# Altium project PCB_Project.PrjPcb
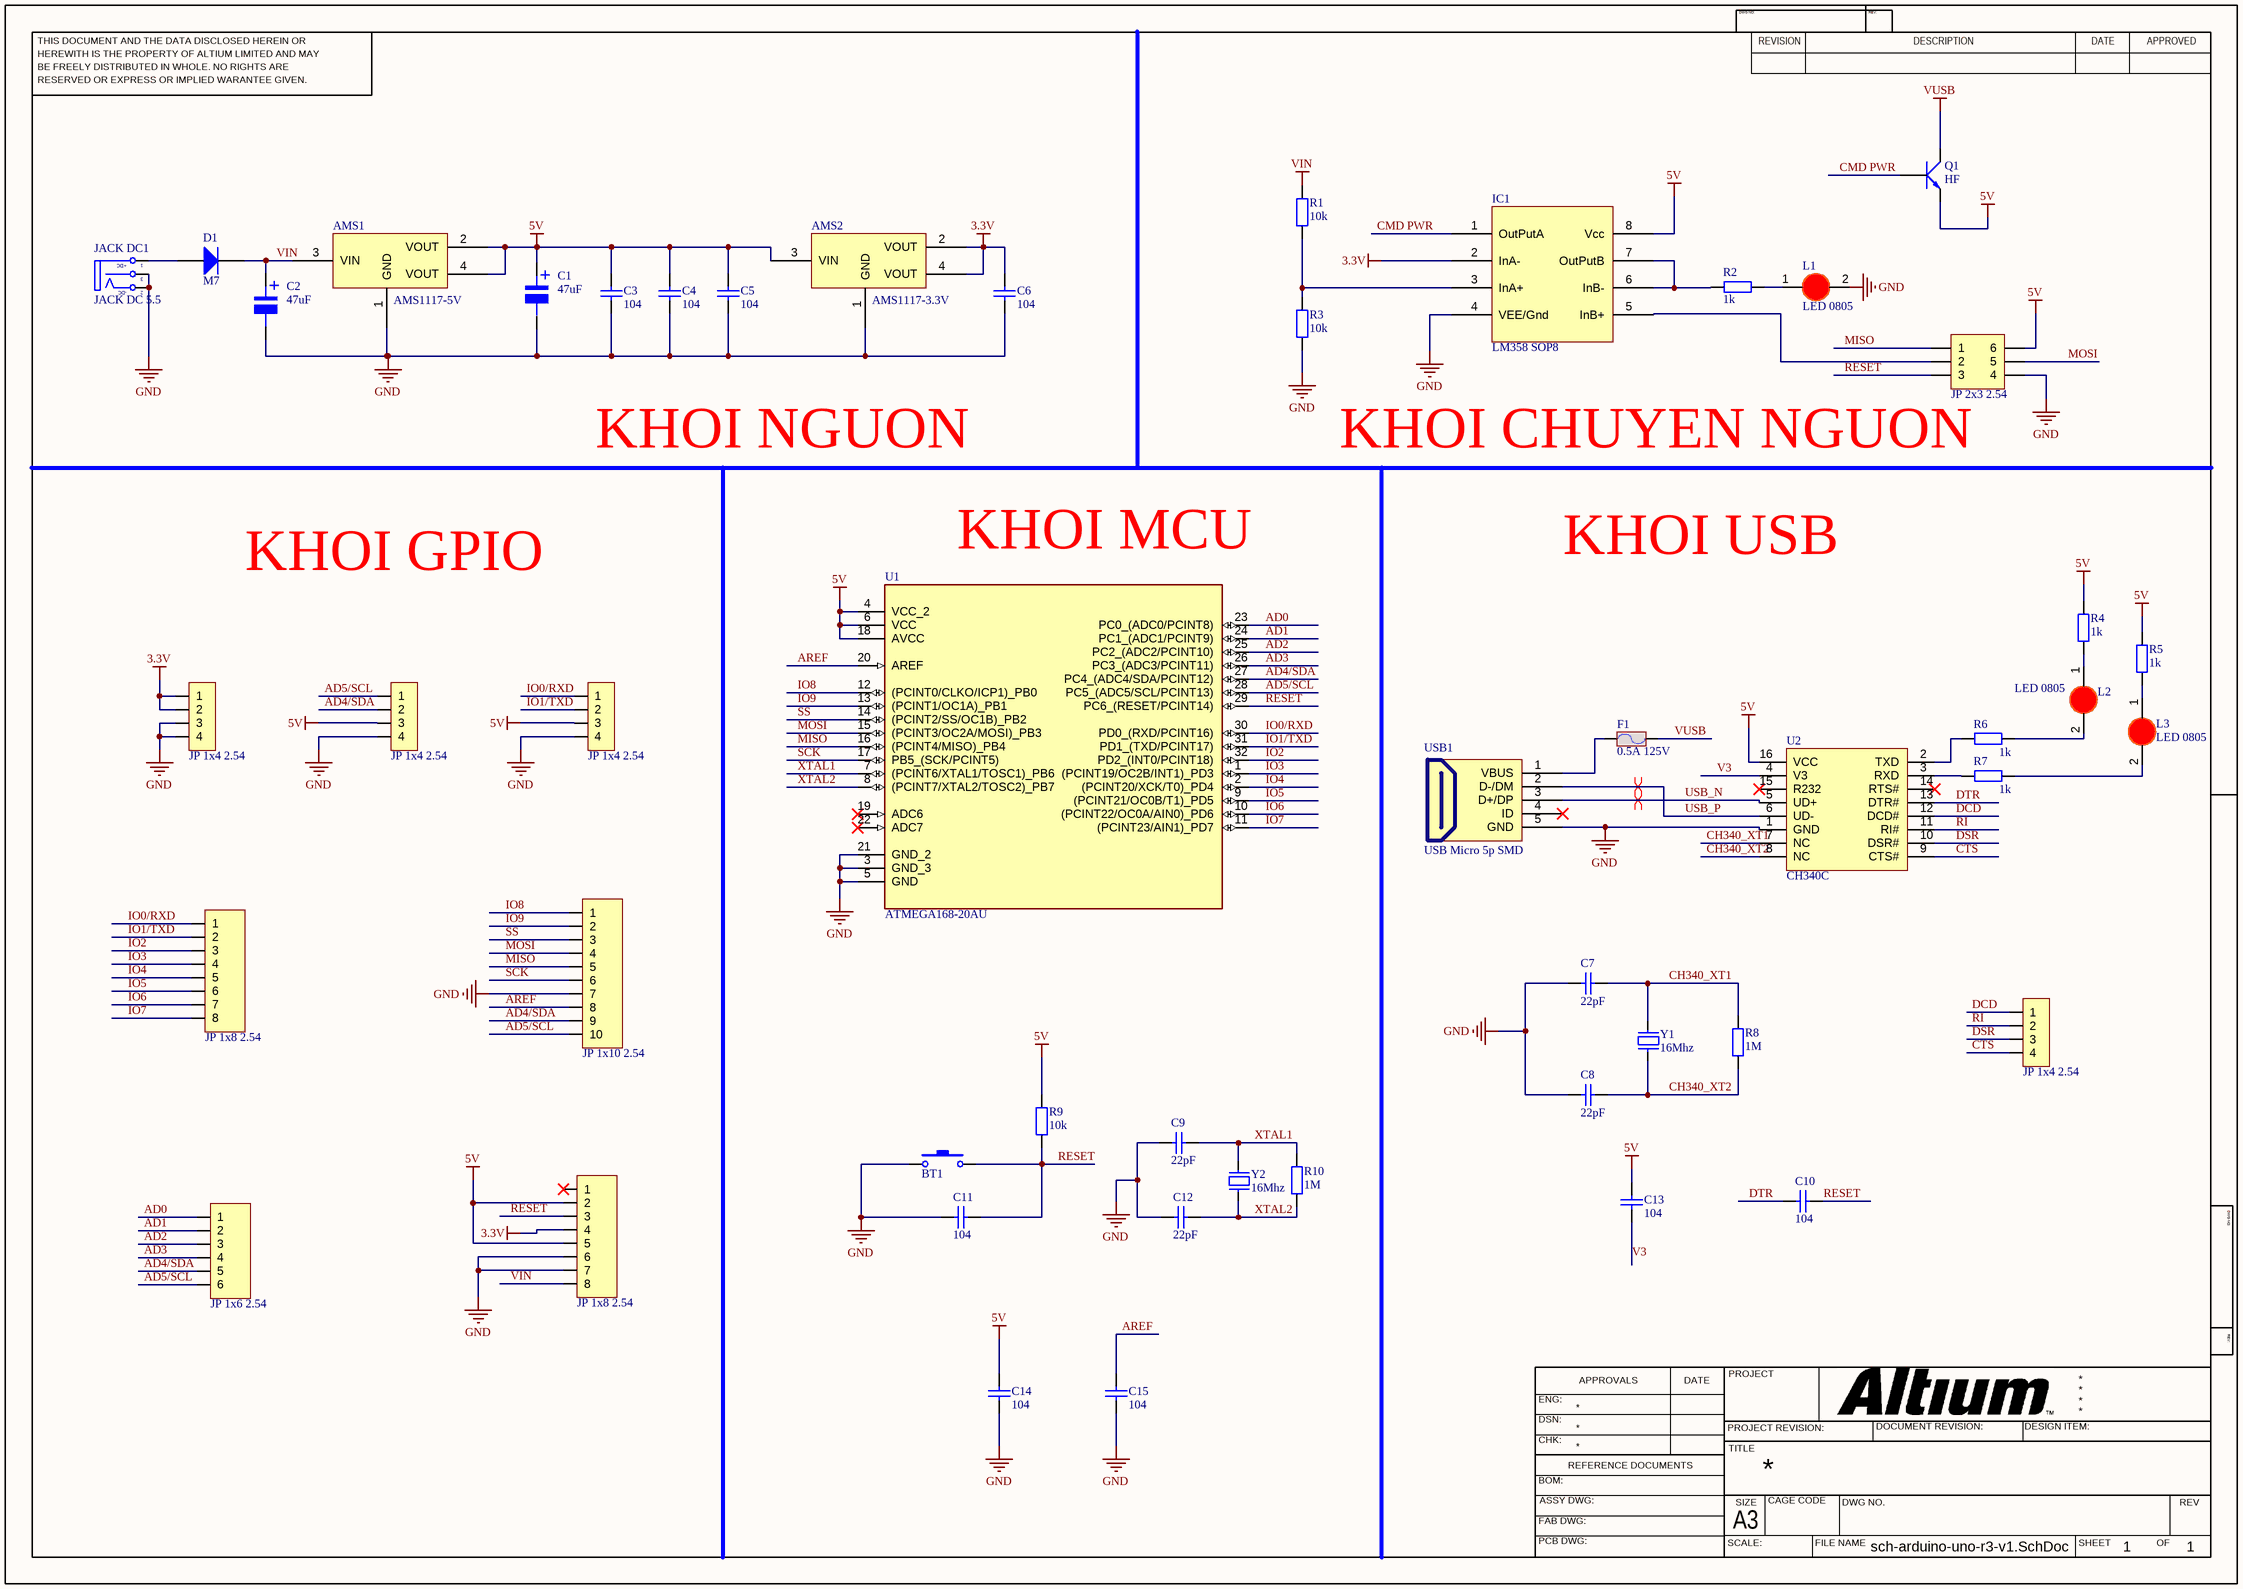
[diagram p0: sch-arduino-uno-r3-v1.SchDoc]
1 sheet, 50 parts. Net scope: global (net labels, ports and power ports of the same name join across sheets).
Board file: pcb-arduino-uno-r3-v1.PcbDoc

## Sheet sch-arduino-uno-r3-v1.SchDoc
size 420 x 297 mm; SheetNumber: 1; SheetTotal: 1

### Parts
AMS1  AMS1117-5V  [SOT223]
AMS2  AMS1117-3.3V  [SOT223]
BT1  Nut Nhan 2 Chan SMD 3x6x2.5  [Nut Nhan 2 Chan SMD 3x6x2.5]  (value not drawn)
C1  47uF  [tu nhom 6.3 (d)]
C2  47uF  [tu nhom 6.3 (d)]
C3  104  [tu 0805]
C4  104  [tu 0805]
C5  104  [tu 0805]
C6  104  [tu 0805]
C7  22pF  [tu 0805]
C8  22pF  [tu 0805]
C9  22pF  [tu 0805]
C10  104  [tu 0805]
C11  104  [tu 0805]
C12  22pF  [tu 0805]
C13  104  [tu 0805]
C14  104  [tu 0805]
C15  104  [tu 0805]
D1  M7  [DIODE SMA]
F1  0.5A 125V  [Cau Chi SMD1808]
IC1  LM358 SOP8  [SOP 8]
JACK_DC1  JACK DC 5.5  [JACK DC 5.5]
JP1  JP 2x3 2.54  [JP 2x3 DT]
JP2  JP 1x4 2.54  [JP 1x4 DT]
JP3  JP 1x4 2.54  [JP 1x4 DT]
JP4  JP 1x4 2.54  [JP 1x4 DT]
JP5  JP 1x10 2.54  [JP 1x10 CT]
JP6  JP 1x8 2.54  [JP 1x8 CT]
JP7  JP 1x4 2.54  [JP 1x4 DT]
JP8  JP 1x8 2.54  [JP 1x8 CT]
JP9  JP 1x6 2.54  [JP 1x6 CT]
L1  LED 0805  [LED-0805-Red]
L2  LED 0805  [LED-0805-Red]
L3  LED 0805  [LED-0805-Red]
Q1  HF  [SOT23]
R1  10k  [tro smd 0805]
R2  1k  [tro smd 0805]
R3  10k  [tro smd 0805]
R4  1k  [tro smd 0805]
R5  1k  [tro smd 0805]
R6  1k  [tro smd 0805]
R7  1k  [tro smd 0805]
R8  1M  [tro smd 0805]
R9  10k  [tro smd 0805]
R10  1M  [tro smd 0805]
U1  ATMEGA168-20AU  [ATMEGA168]
U2  CH340C  [SOIC16_50_284_25X90_SMT]
USB1  USB Micro 5p SMD  [USB Micro 5p SMD]
Y1  16Mhz  [Thach Anh 2 chan SMD]
Y2  16Mhz  [Thach Anh 2 chan SMD]

### Nets
3.3V: AMS2.2(VOUT) AMS2.4(VOUT) C6.1 IC1.2(InA-) JP2.1 JP2.2 JP8.4
5V: AMS1.2(VOUT) AMS1.4(VOUT) AMS2.3(VIN) C1.1 C3.1 C4.1 C5.1 C13.1 C14.1 IC1.8(Vcc) JP1.6 JP3.3 JP4.3 JP8.2 JP8.5 Q1.2(E) R4.2 R5.2 R9.2 U1.4(VCC_2) U1.6(VCC) U1.18(AVCC) U2.16(VCC)
GND: AMS1.1(GND) AMS2.1(GND) BT1.1 C1.2 C2.2 C3.2 C4.2 C5.2 C6.2 C7.2 C8.2 C9.2 C11.2 C12.2 C14.2 C15.2 IC1.4(VEE/Gnd) JACK_DC1.2(TN) JACK_DC1.3(S) JP1.4 JP2.3 JP2.4 JP3.4 JP4.4 JP5.7 JP8.6 JP8.7 L1.2(K) R3.1 U1.3(GND_3) U1.5(GND) U1.21(GND_2) U2.1(GND) USB1.5(GND)
VIN: AMS1.3(VIN) C2.1 D1.2(K) JP8.8 R1.2
VUSB: F1.2 Q1.3(C)
AD0: JP9.1 U1.23(PC0_(ADC0/PCINT8))
AD1: JP9.2 U1.24(PC1_(ADC1/PCINT9))
AD2: JP9.3 U1.25(PC2_(ADC2/PCINT10))
AD3: JP9.4 U1.26(PC3_(ADC3/PCINT11))
AD4/SDA: JP3.2 JP5.9 JP9.5 U1.27(PC4_(ADC4/SDA/PCINT12))
AD5/SCL: JP3.1 JP5.10 JP9.6 U1.28(PC5_(ADC5/SCL/PCINT13))
AREF: C15.1 JP5.8 U1.20(AREF)
CH340_XT1: C7.1 R8.2 U2.7(NC) Y1.2
CH340_XT2: C8.1 R8.1 U2.8(NC) Y1.1
CMD PWR: IC1.1(OutPutA) Q1.1(B)
CTS: JP7.4 U2.9(CTS#)
DCD: JP7.1 U2.12(DCD#)
DSR: JP7.3 U2.10(DSR#)
DTR: C10.1 U2.13(DTR#)
IO0/RXD: JP4.1 JP6.1 U1.30(PD0_(RXD/PCINT16))
IO1/TXD: JP4.2 JP6.2 U1.31(PD1_(TXD/PCINT17))
IO2: JP6.3 U1.32(PD2_(INT0/PCINT18))
IO3: JP6.4 U1.1((PCINT19/OC2B/INT1)_PD3)
IO4: JP6.5 U1.2((PCINT20/XCK/T0)_PD4)
IO5: JP6.6 U1.9((PCINT21/OC0B/T1)_PD5)
IO6: JP6.7 U1.10((PCINT22/OC0A/AIN0)_PD6)
IO7: JP6.8 U1.11((PCINT23/AIN1)_PD7)
IO8: JP5.1 U1.12((PCINT0/CLKO/ICP1)_PB0)
IO9: JP5.2 U1.13((PCINT1/OC1A)_PB1)
MISO: JP1.1 JP5.5 U1.16((PCINT4/MISO)_PB4)
MOSI: JP1.5 JP5.4 U1.15((PCINT3/OC2A/MOSI)_PB3)
RESET: BT1.2 C10.2 C11.1 JP1.3 JP8.3 R9.1 U1.29(PC6_(RESET/PCINT14))
RI: JP7.2 U2.11(RI#)
SCK: JP5.6 U1.17(PB5_(SCK/PCINT5))
SS: JP5.3 U1.14((PCINT2/SS/OC1B)_PB2)
USB_N: U2.5(UD+) USB1.3(D+/DP)
USB_P: U2.6(UD-) USB1.2(D-/DM)
V3: C13.2 U2.4(V3)
XTAL1: C9.1 R10.2 U1.7((PCINT6/XTAL1/TOSC1)_PB6) Y2.2
XTAL2: C12.1 R10.1 U1.8((PCINT7/XTAL2/TOSC2)_PB7) Y2.1
NetD1_1: D1.1(A) JACK_DC1.1(T)
NetF1_1: F1.1 USB1.1(VBUS)
NetIC1_3: IC1.3(InA+) R1.1 R3.2
NetIC1_5: IC1.5(InB+) JP1.2
NetIC1_6: IC1.6(InB-) IC1.7(OutPutB) R2.1
NetL1_1: L1.1(A) R2.2
NetL2_1: L2.1(A) R4.1
NetL2_2: L2.2(K) R6.2
NetL3_1: L3.1(A) R5.1
NetL3_2: L3.2(K) R7.2
NetR6_1: R6.1 U2.2(TXD)
NetR7_1: R7.1 U2.3(RXD)

Not connected (* = marked no-connect by the designer): JP8 1*; U1 19(ADC6)* 22(ADC7)*; U2 14(RTS#)* 15(R232)*; USB1 4(ID)*

### Layout directives
differential pair: USB_N, USB_P

### Notes on the sheet
- KHOI NGUON
- KHOI CHUYEN NGUON
- KHOI GPIO
- (near U1) KHOI MCU
- KHOI USB
- THIS DOCUMENT AND THE DATA DISCLOSED HEREIN OR
- HEREWITH IS THE PROPERTY OF ALTIUM LIMITED AND MAY
- DWG NO:
- REVISION
- REV:
- DESCRIPTION
- DATE
- APPROVED
- BE FREELY DISTRIBUTED IN WHOLE. NO RIGHTS ARE
- RESERVED OR EXPRESS OR IMPLIED WARANTEE GIVEN.
- ENG:
- APPROVALS
- PROJECT
- DSN:
- CHK:
- REFERENCE DOCUMENTS
- PROJECT REVISION:
- TITLE
- DOCUMENT REVISION:
- DESIGN ITEM:
- BOM:
- FAB DWG:
- PCB DWG:
- ASSY DWG:
- SCALE:
- A3
- SIZE
- CAGE CODE
- FILE NAME
- DWG NO.
- SHEET
- OF
- REV
- (in symbol JACK DC 5.5) +DC; -DC
- (in symbol Tu Nhom 47uF 50V) +

### Library data of the parts
AMS1 = AMS1117 SMD: Dán; Value: AMS1117-3.3V SOT223; Don_Vi: Con; Ma_Hang: MH000596; Ghi_Chu: *; Kieu_Chan: *; Chung_Loai: Dán
AMS2 = AMS1117 SMD_1: Dán; Value: AMS1117-3.3V SOT223; Don_Vi: Con; Ma_Hang: MH000596; Ghi_Chu: *; Kieu_Chan: *; Chung_Loai: Dán
BT1 = Nut Nhan 2 Chan SMD 3x6x2.5: Ma_Hang: MH001036; Ten: Nút Nhấn 2 Chân 3x6x2.5MM SMD
C1 C2 = Tu Nhom 47uF 50V: Dán; Don_Vi: Con; So_Chan: 2; Ten_Linh_Kien: Tụ Nhôm 47uF 50V 6.3x5.5MM; Ma_Hang: MH002217; Chung_Loai: Dán; Kieu_Chan: *
C3-C6 C10 C11 C13-C15 = Tu 0805 104 50V 10%: Dán; Don_Vi: Con; So_Chan: 2; Ten_Linh_Kien: Tụ 0805 104-100nF 10% 50V; Ma_Hang: MH004551; Chung_Loai: Dán; Kieu_Chan: *
C7-C9 C12 = Tu 0805 22pF 50V 10%: Dán; Don_Vi: Con; So_Chan: 2; Ten_Linh_Kien: Tụ 0805 22P 10% 50V; Ma_Hang: MH004560; Chung_Loai: Dán; Kieu_Chan: *
D1 = Diode M7 ( 4007 ): Dán; Don_Vi: Con; Ten_Linh_Kien: Diode M7 1N4007 SMD 1A 1000V; Ma_Hang: MH000944; Chung_Loai: Dán; Ghi_Chu: *
F1 = Cau chi 0.5A 125V SMD1808: Ma_Hang: MH009241; Ten: Cầu Chì 0.5A 125V SMD1808 0451.500MRL
IC1 = LM358 SOP8: Dán; Ma_Hang: MH000609; Don_Vi: Con; Ten_Linh_Kien: LM358 SOP8; Kieu_Chan: *; Ghi_Chu: *; Chung_Loai: Dán
JACK_DC1 = JACK DC 5.5: Value: Jac DC
JP1 = JP 2x3 2.54 Duc Thang: Cắm; Ten_Linh_Kien: Jump Đôi Đực 2.54MM 2x40P Thẳng 11MM; Don_Vi: Con; Ma_Hang: MH002686; Ghi_Chu: *; Kieu_Chan: *; Chung_Loai: Cắm
JP2-JP4 JP7 = JP 1x4 2.54 Duc Thang: Cắm; Ten_Linh_Kien: Jump Đơn Đực 2.54MM 1x40P Thẳng 11MM; Don_Vi: Con; Ma_Hang: MH000903; Ghi_Chu: *; Kieu_Chan: *; Chung_Loai: Cắm
JP5 = JP 1x10 2.54 Cai Thang: Cắm; Ten_Linh_Kien: Jump Đơn Cái 2.54MM 1x20P Thẳng; Don_Vi: Con; Ma_Hang: MH004006; Ghi_Chu: *; Kieu_Chan: *; Chung_Loai: Cắm
JP6 JP8 = JP 1x8 2.54 Cai Thang: Cắm; Ten_Linh_Kien: Jump Đơn Cái 2.54MM 1x20P Thẳng; Don_Vi: Con; Ma_Hang: MH004006; Ghi_Chu: *; Kieu_Chan: *; Chung_Loai: Cắm
JP9 = JP 1x6 2.54 Cai Thang: Cắm; Ten_Linh_Kien: Jump Đơn Cái 2.54MM 1x20P Thẳng; Don_Vi: Con; Ma_Hang: MH004006; Ghi_Chu: *; Kieu_Chan: *; Chung_Loai: Cắm
L1-L3 = LED 0805 Do: Dán; Don_Vi: Con; Ma_Hang: MH000897; Ten_Linh_Kien: LED 0805 Màu Đỏ (Red); Ghi_Chu: *; Kieu_Chan: *; Chung_Loai: Dán
Q1 = C1815 HF SMD: NPN transistor; Value: C9014
R1 R3 R9 = Tro 0805 5% 10k: Dán; Don_Vi: Con; So_Chan: 2; Ten_Linh_Kien: Trở 0805 5% 10k; Ma_Hang: MH005239; Chung_Loai: Dán; Kieu_Chan: *
R2 R4-R7 = Tro 0805 1% 1k: Dán; Don_Vi: Con; So_Chan: 2; Ten_Linh_Kien: Trở 0805 1% 1k; Ma_Hang: MH005468; Chung_Loai: Dán; Kieu_Chan: *
R8 R10 = Tro 0805 5% 1M: Dán; Don_Vi: Con; So_Chan: 2; Ten_Linh_Kien: Trở 0805 5% 1M; Ma_Hang: MH005235; Chung_Loai: Dán; Kieu_Chan: *
U1 = ATMEGA168-20AU: AVR AVRÂ® ATmega Microcontroller IC 8-Bit 20MHz 16KB _8K x 16_ FLASH 32-TQFP _7x7_; MF: Microchip; MP: ATMEGA168-20AU; Availability: Unavailable; Package: TQFP-32 Microchip; Price: None; SnapEDA_Link: https://www.snapeda.com/parts/ATMEGA168-20AU/Microchip/view-part/776709/?ref=snap; Value: *
U2 = IC_CH340C: USB Bridge, USB to UART USB 2.0 UART Interface; Manufacturer: Olimex; Alternate Part Number-1: NA; Manufacturer Part Number: CH340C; Case/Package: SOIC16; Supplier-1: LCSC; Supplier Part Number-1: C84681
USB1 = USB Micro 5p SMD: USB Type B; Ten: MicroUSB MK5P SMD; Ma_Hang: MH001020
Y1 Y2 = Thach Anh 2 chan SMD: Crystal For all Crystal 2pin.; Value: 4Mhz